# EAGLE design MCP1603-breakout (EAGLE 9.3.2)
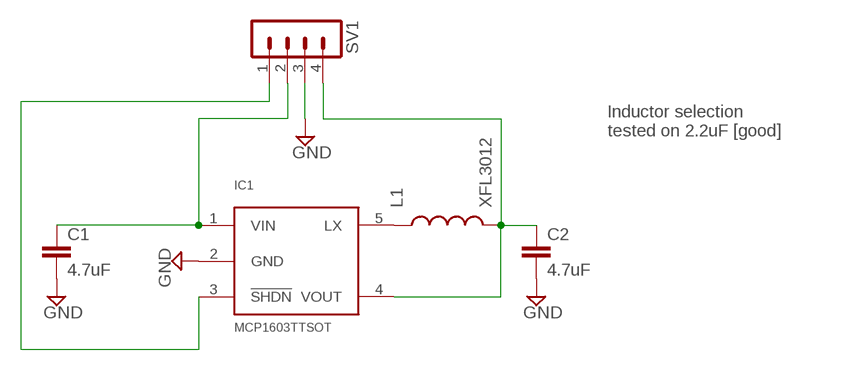
[diagram p0: schematic, sheet 1]

## Parts
C1  4.7uF  C-EUC0603  [C0603]
C2  4.7uF  C-EUC0603  [C0603]
IC1  MCP1603TTSOT  [TSOT23-6]
L1  XFL3012  [XFL3012]
SV1  MA04-1  [MA04-1]

## Nets
GND: C1.2 C2.2 IC1.2(GND) SV1.3
N$1: C1.1 IC1.1(VIN) SV1.2
N$2: C2.1 IC1.4(VOUT) L1.2 SV1.4
N$3: IC1.5(LX) L1.1
N$4: IC1.3(!SHDN) SV1.1

## Notes on the sheet
- Inductor selection
  tested on 2.2uF [good]

## Library data of the parts
C1 C2 = rcl:C-EU: CAPACITOR, European symbol; SPICEPREFIX: C
IC1 = power:MCP1603T
L1 = my-inductors:XFL3012
SV1 = con-lstb:MA04-1: PIN HEADER; OC_FARNELL: unknown; OC_NEWARK: unknown

## Board
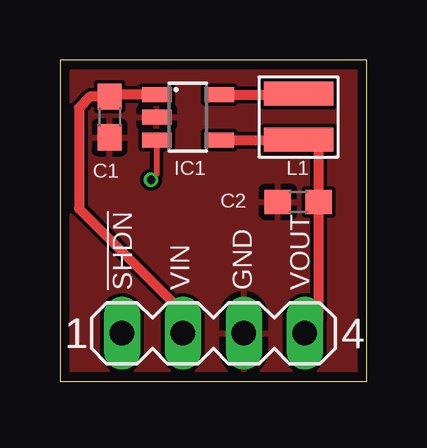
[diagram p1: board, top side]
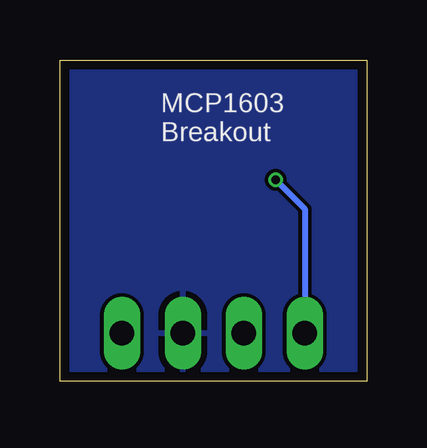
[diagram p2: board, bottom side, seen from below]

Size 12.8 x 13.4 mm. Coordinates in mm from the lower left corner, seen from the top.
Outline: 0,0 12.8,0 12.8,13.4 0,13.4 0,0
Copper layers (1*16): Top 0.035559375mm / dielectric 1.6mm / Bottom 0.035559375mm
Design rules "oshpark-2layer": minimum track width 6mil, minimum drill 10mil, track to track 6mil, track to pad 6mil, pad to pad 6mil, via to via 6mil, smd to smd 6mil, copper to edge 15mil, drill to drill 6mil, minimum pad ring 5mil, minimum via ring 5mil, stop-mask expansion 2.5mil, vias tented up to drill 0mil, thermal gap 10mil

### Footprints (pad centres in the part's own frame; a part is rotated, then mirrored left to right if it is on the bottom)
C0603 = smd 1.1 x 1: 1 -0.85,0; 2 0.85,0
TSOT23-6 = smd 0.62 x 1.22: 1 -0.95,-1.3; 2 0,-1.3; 3 0.95,-1.3; 4 0.95,1.3; 5 -0.95,1.3
XFL3012 = smd 1 x 2.9: 1 0.5,1.45; 2 2.43,1.45
MA04-1 = drill 1.016 long: 1 -3.81,0; 2 -1.27,0; 3 1.27,0; 4 3.81,0

### Placement (x,y rotation side)
C1  2.07,11.02 270 top
C2  9.94,7.48 180 top
IC1  5.34,11.01 270 top
L1  8.5,12.5 270 top
SV1  6.4,2 0 top

### Tracks (layer width: path | path; a pad name or v marks a point on that pad's centre or on a via)
GND
  pour Top: 0,0 12.8,0 12.8,13.4 0,13.4
  pour Bottom: 0,13.4 0,0 12.8,0 12.8,13.4
N$1
  Top 0.406: IC1.1 2.16,11.96 C1.1 1.27,11.87 0.8,11.4 0.8,7.2 5.13,2.87 SV1.2
N$2
  Top 0.406: IC1.4 L1.2 10.79,10.07 C2.1 10.79,2.58 SV1.4
N$3
  Top 0.406: IC1.5 9.91,11.96 L1.1
N$4  (via drill 0.35)
  Top 0.254: IC1.3 4.04,8.64 v3.8,8.4
  Bottom 0.254: v3.8,8.4 2.59,7.19 SV1.1

### Text on the board
tPlace: !SHDN | VIN | GND | VOUT
bPlace: MCP1603 / Breakout